# Altium schematic sheet SDCard.SchDoc
size A4; SheetNumber: 5; SheetTotal: 14
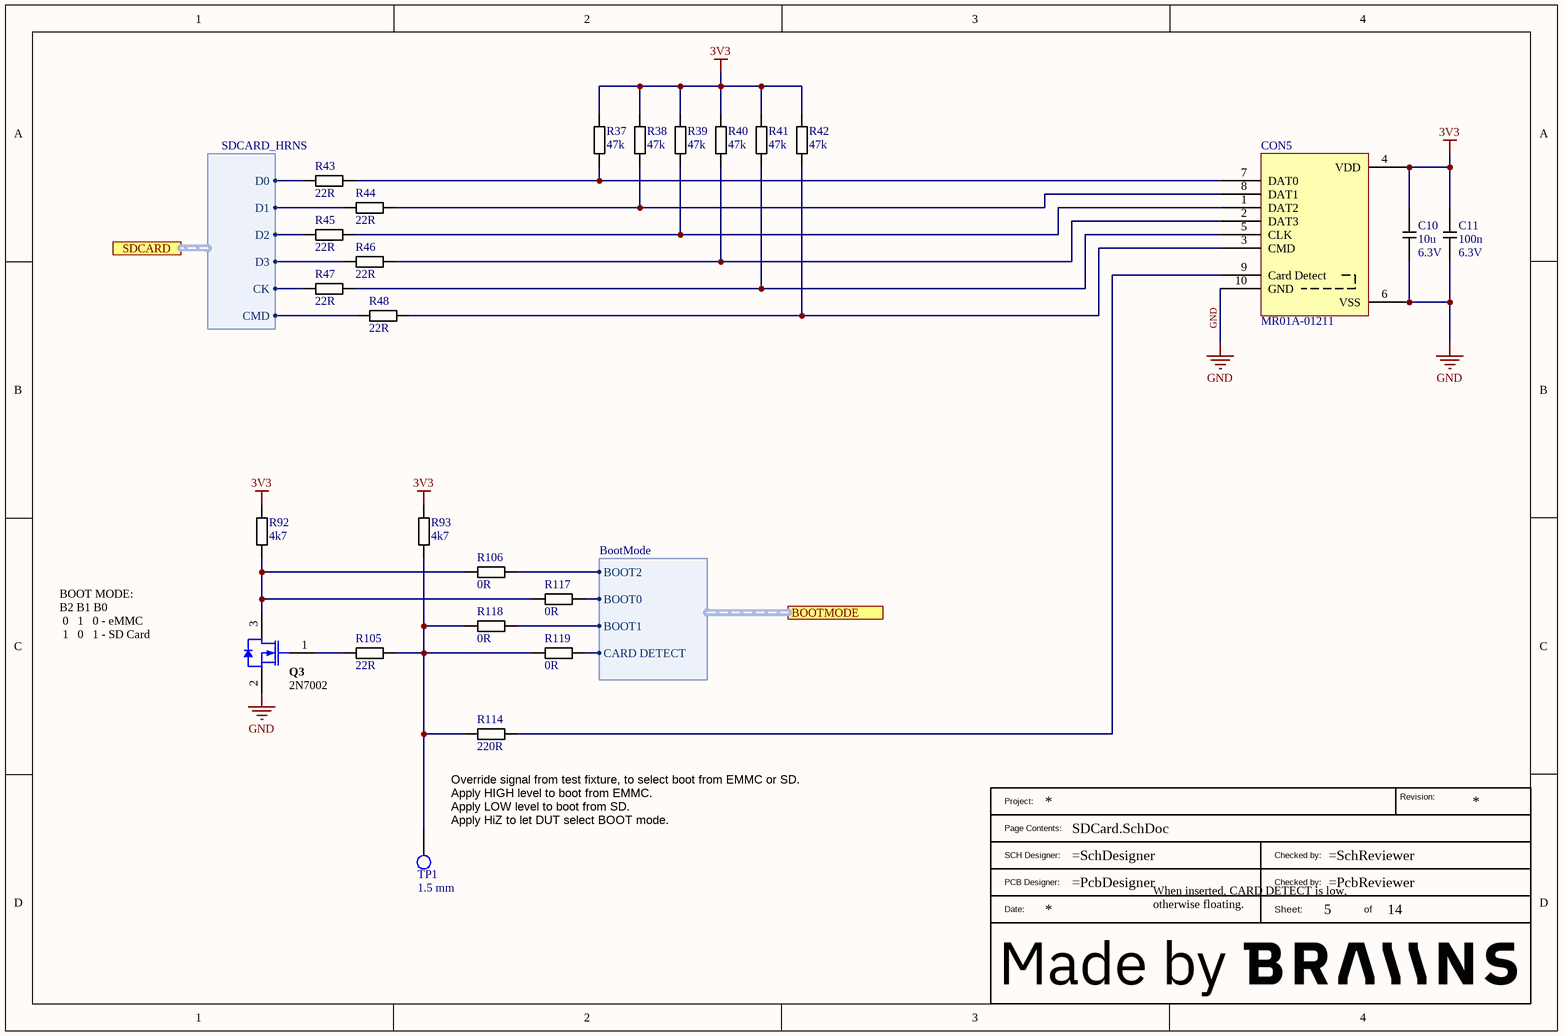
[diagram p0: SDCard.SchDoc]

## Parts
?  BraiinsTitleBlockWithLogo  (value not drawn)  (graphical)
C10  Voltage_Rating: 6.3V  [CAP0805]  (hidden comment: 10u)
C11  Voltage_Rating: 6.3V  [CAP0402]  (hidden comment: 100n)
CON5  MR01A-01211  [MR01A01211]
Q3  2N7002  [INF-PG-SOT23_M]
R37  47k  [RES0402]
R38  47k  [RES0402]
R39  47k  [RES0402]
R40  47k  [RES0402]
R41  47k  [RES0402]
R42  47k  [RES0402]
R43  22R  [RES0402]
R44  22R  [RES0402]
R45  22R  [RES0402]
R46  22R  [RES0402]
R47  22R  [RES0402]
R48  22R  [RES0402]
R92  4k7  [RES0402]
R93  4k7  [RES0402]
R105  22R  [RES0402]
R106  0R  [RES0402]
R114  220R  [RES0402]
R117  0R  [RES0402]
R118  0R  [RES0402]
R119  0R  [RES0402]
TP1  1.5 mm  [TESTPOINT_1_5MM]

## Ports
BOOTMODE (harness BootMode), SDCARD (harness SDCARD_HRNS)

## Harnesses
SDCARD_HRNS: CK, CMD, D0, D1, D2, D3
BootMode: BOOT2, BOOT0, BOOT1, CARD DETECT

## Nets
3V3: C10.1 C11.1 CON5.4(VDD) R37.1 R38.1 R39.1 R40.1 R41.1 R42.1 R92.1 R93.1
GND: C10.2 C11.2 CON5.6(VSS) CON5.10(GND) Q3.2(SOURCE)
NetCON5_1: CON5.1(DAT2) R39.2 R45.2
NetCON5_2: CON5.2(DAT3) R40.2 R46.2
NetCON5_3: CON5.3(CMD) R42.2 R48.2
NetCON5_5: CON5.5(CLK) R41.2 R47.2
NetCON5_7: CON5.7(DAT0) R37.2 R43.2
NetCON5_8: CON5.8(DAT1) R38.2 R44.2
NetCON5_9: CON5.9(Card_Detect) R114.2
NetQ3_1: Q3.1(GATE) R105.1
NetQ3_3: Q3.3(DRAIN) R92.2 R106.1 R117.1
NetR43_1: R43.1 ; port SDCARD.D0
NetR44_1: R44.1 ; port SDCARD.D1
NetR45_1: R45.1 ; port SDCARD.D2
NetR46_1: R46.1 ; port SDCARD.D3
NetR47_1: R47.1 ; port SDCARD.CK
NetR48_1: R48.1 ; port SDCARD.CMD
NetR93_2: R93.2 R105.2 R114.1 R118.1 R119.1 TP1.1
NetR106_2: R106.2 ; port BOOTMODE.BOOT2
NetR117_2: R117.2 ; port BOOTMODE.BOOT0
NetR118_2: R118.2 ; port BOOTMODE.BOOT1
NetR119_2: R119.2 ; port BOOTMODE.CARD DETECT

## Notes on the sheet
- BOOT MODE:
  B2 B1 B0
  0   1   0 - eMMC
  1   0   1 - SD Card
- (near R114) Override signal from test fixture, to select boot from EMMC or SD.
- Apply HIGH level to boot from EMMC.
- Apply LOW level to boot from SD.
- (near TP1) Apply HiZ to let DUT select BOOT mode.
- When inserted, CARD DETECT is low, otherwise floating.
- (in symbol BraiinsTitleBlockWithLogo) Revision:; Project:; Page Contents:; SCH Designer:; Checked by:; PCB Designer:; Date:; Sheet:; of

## Library data of the parts
C10 = 30174: CAP CER 10u 10% 6.3V X7R 0805; Part_Type: Capacitor; Part_Status: New; ID: 30174; Updated By: janjuranek; Sorted_Value: 10; Value: 10u; Sub_Type: CER; Manufacturer Part Description: CAP CER 10u 10% 6.3V X7R 0805; Package_Case: 0805; RoHS: Yes; Dielectric: X7R; Tolerance: 10%; Created By: janjuranek; Created_Date: 2023-05-09 02:18:46; Updated_Date: 2023-05-09 02:19:22; ComponentLink1Description: Datasheet; ComponentLink2Description: Supplier Part Details
C11 = 30154: CAP CER 100n 10% 6.3V 0402; Part_Type: Capacitor; Part_Status: New; ID: 30154; Dielectric: X7R; Updated By: janjuranek; Sorted_Value: 100; Value: 100n; Sub_Type: CER; Manufacturer Part Description: CAP CER 100n 10% 6.3V 0402; Package_Case: 0402; RoHS: Yes; Tolerance: 10%; Created By: janjuranek; Created_Date: 2023-05-01 19:17:49; Updated_Date: 2023-05-01 19:19:14; ComponentLink1Description: Datasheet; ComponentLink2Description: Supplier Part Details
CON5 = 30104: Micro SD card connector with card detect; Part_Status: New; ID: 30104; Updated By: janjuranek; Value: MR01A-01211; Part_Type: Connector; Manufacturer Part Number: MR01A-01211; Manufacturer Part Description: Micro SD card connector with card detect; RoHS: Yes; Created By: janjuranek; Created_Date: 2023-03-14 04:17:57; Updated_Date: 2023-03-22 18:19:20; ComponentLink1Description: Datasheet; ComponentLink2Description: Supplier Part Details; ComponentLink1URL: ATOM-TECH-MR01A-01211.pdf
Q3 = CMP-1149-00026-1: N-Channel OptiMOS Small-Signal-Transistor, 60 V VDS, 0.3 A ID, -55 to 150 degC, PG-SOT23, Reel, Green; Manufacturer: Infineon; RDS (on) (max) (@4.5V): 4,000 mOhm; VDS (max): 60 V; IDpuls (max): 1.2Â A; QG: 0.4Â nC; RDS (on) (max): 3,000 mOhm; RthJA (max): 250 K/W; ID (max): 0.3Â A; VGS(th) (max): 2.5Â V; VGS(th) (min): 1.5Â V; Green: TRUE; Ptot (max): 0.5Â W; PackageDescription: 3-Pin Small Outline Transistor Package, 2.9 x 1.3 mm Body, 0.95 mm Pitch; Halogen-free: TRUE; ComponentLink2Description: Datasheet; ComponentLink1URL: http://www.infineon.com/; Packing: Reel; DatasheetVersion: Rev. 2.4; PartNumber: 2N7002; PackageReference: PG-SOT23; PackageVersion: Apr-08; ComponentLink3URL: http://www.infineon.com/dgdl/SOT23-Package_Overview.pdf?folderId=db3a30431936bc4b0119532290053c66&fileId=db3a30431936bc4b0119533468123c85; ComponentLink1Description: Manufacturer URL; Mounting Technology: Surface Mount; ComponentLink3Description: Package Specification; ComponentLink2URL: http://www.infineon.com/dgdl/2N7002_Rev2.4.pdf?folderId=db3a3043156fd573011622e10b5c1f67&fileId=db3a304319bc939a0119c2a9461e79e6
R37-R42 = 30157: RES 47k Ohm 1% 0402; Part_Status: New; ID: 30157; Updated By: janjuranek; Sorted_Value: 47000; Value: 47k; Part_Type: Resistor; Manufacturer Part Description: RES 47k Ohm 1% 0402; Package_Case: 0402; Tolerance: 1%; Created By: janjuranek; Created_Date: 2023-05-01 19:31:45; Updated_Date: 2023-05-01 19:31:58; ComponentLink1Description: Datasheet; ComponentLink2Description: Supplier Part Details; RoHS: Yes
R43-R48 R105 = 30156: RES 22R Ohm 1% 0402; Part_Status: New; ID: 30156; Updated By: janjuranek; Sorted_Value: 22; Value: 22R; Part_Type: Resistor; Manufacturer Part Description: RES 22R Ohm 1% 0402; Package_Case: 0402; Tolerance: 1%; Created By: janjuranek; Created_Date: 2023-05-01 19:29:39; Updated_Date: 2023-05-01 19:30:05; ComponentLink1Description: Datasheet; ComponentLink2Description: Supplier Part Details; RoHS: Yes
R92 R93 = 30073: RES 4k7 Ohm 1% 0402; Part_Status: New; ID: 30073; Updated By: Jan; Sorted_Value: 4; Value: 4k7; Part_Type: Resistor; Manufacturer Part Description: RES 4k7 Ohm 1% 0402; Package_Case: 0402; RoHS: Yes; Temperature Range: -40 to +150C; Tolerance: 1%; Created By: Jan; Created_Date: 2023-03-02 13:15:12; Updated_Date: 2023-03-02 13:15:46; ComponentLink1Description: Datasheet; ComponentLink2Description: Supplier Part Details
R106 R117-R119 = 30178: RES 0R Ohm 1% 0402; Part_Status: New; ID: 30178; Updated By: janjuranek; Sorted_Value: 0; Value: 0R; Part_Type: Resistor; Manufacturer Part Description: RES 0R Ohm 1% 0402; Package_Case: 0402; RoHS: Yes; Tolerance: 1%; Created By: janjuranek; Created_Date: 2023-05-15 08:47:05; Updated_Date: 2023-05-15 08:47:18; ComponentLink1Description: Datasheet; ComponentLink2Description: Supplier Part Details
R114 = 30216: RES 220R Ohm 1% 0402; Part_Status: New; ID: 30216; Updated By: janjuranek; Sorted_Value: 220; Value: 220R; Part_Type: Resistor; Manufacturer Part Description: RES 220R Ohm 1% 0402; Package_Case: 0402; RoHS: Yes; Tolerance: 1%; Created By: janjuranek; Created_Date: 2023-08-08 14:57:40; Updated_Date: 2023-08-08 14:57:56; ComponentLink1Description: Datasheet; ComponentLink2Description: Supplier Part Details
TP1 = 30199: Testpoint SMT 1.5mm; Part_Status: New; ID: 30199; Updated By: janjuranek; Value: 1.5 mm; Part_Type: Testpoint; Manufacturer Part Description: Testpoint SMT 1.5mm; Created By: janjuranek; Created_Date: 2023-06-22 13:58:58; Updated_Date: 2023-06-22 14:00:13; ComponentLink1Description: Datasheet; ComponentLink2Description: Supplier Part Details